# EAGLE schematic 01 (EAGLE 6.5.0)
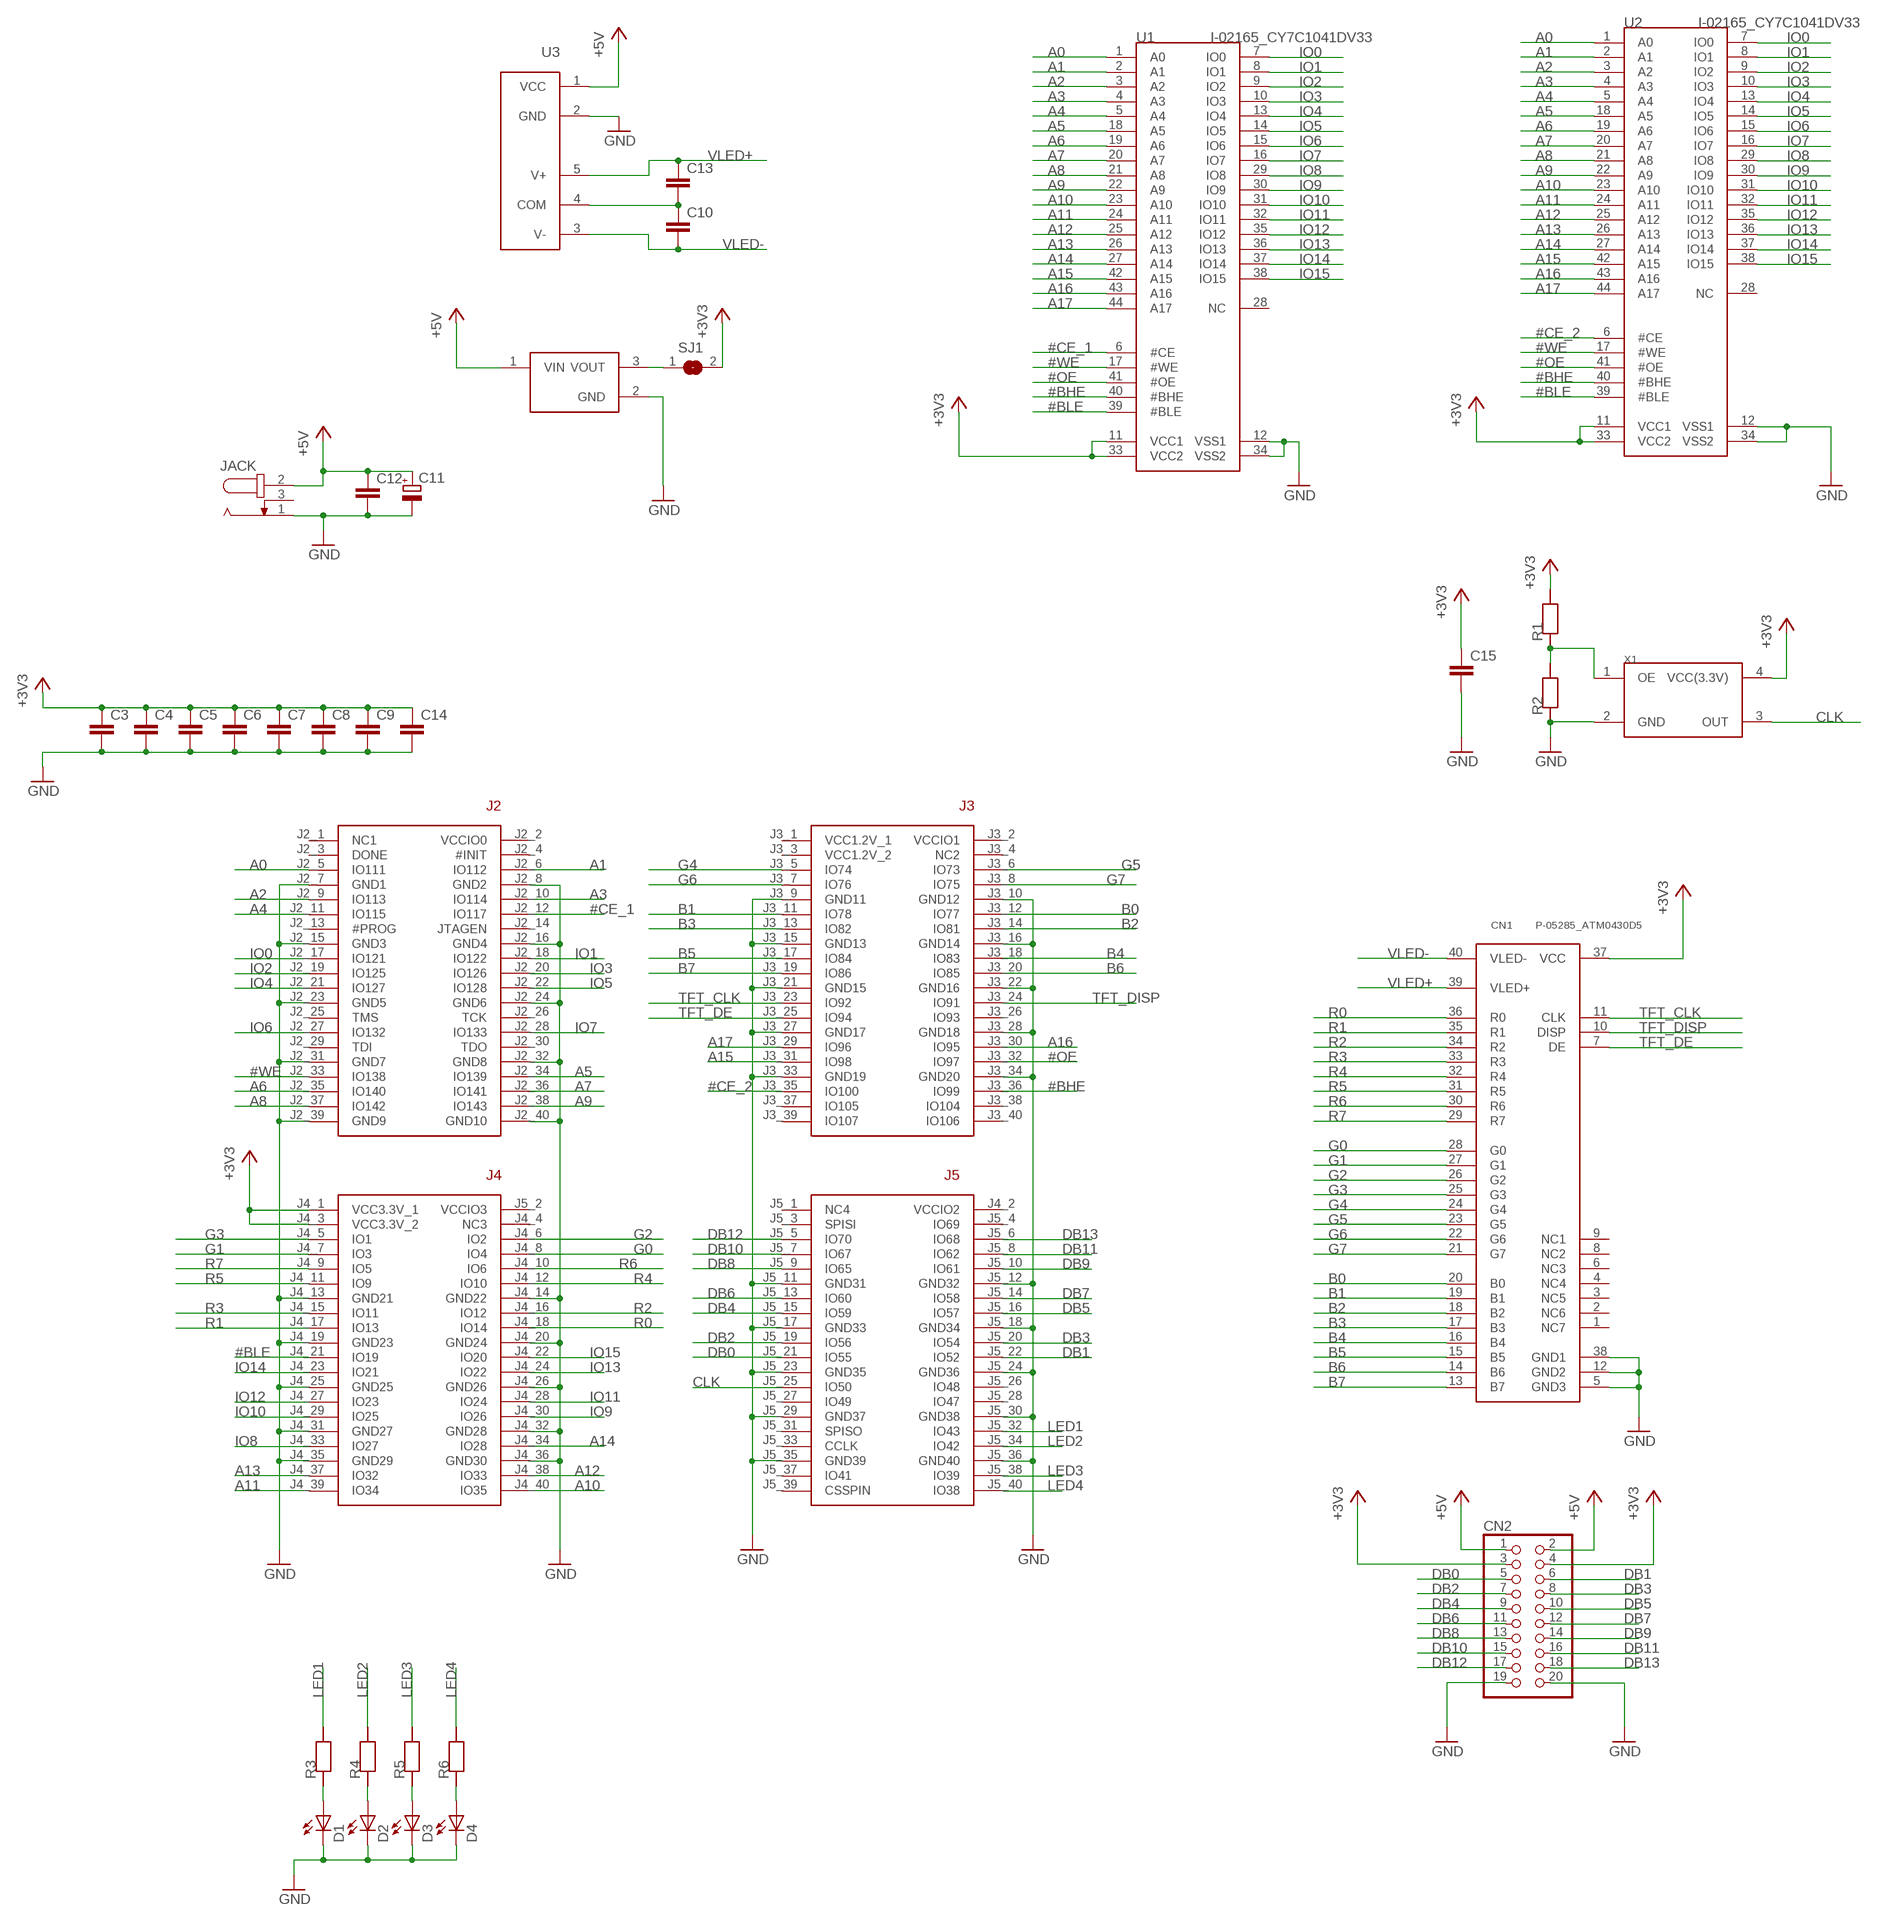
[diagram p0: schematic, sheet 1]

## Parts
C3  C_1068  [C0603]
C4  C_1068  [C0603]
C5  C_1068  [C0603]
C6  C_1068  [C0603]
C7  C_1068  [C0603]
C8  C_1068  [C0603]
C9  C_1068  [C0603]
C10  C_1068  [C0603]
C11  CPOL  [153CLV-0605]
C12  C_1068  [C0603]
C13  C_1068  [C0603]
C14  C_1068  [C0603]
C15  C_1068  [C0603]
CN1  P-05285_ATM0430D5  [FH-40S-0.5SH_0.5]
CN2  PINHD-2X10  [2X10]
D1  LEDCHIPLED_0805  [CHIPLED_0805]
D2  LEDCHIPLED_0805  [CHIPLED_0805]
D3  LEDCHIPLED_0805  [CHIPLED_0805]
D4  LEDCHIPLED_0805  [CHIPLED_0805]
JACK  C-01604_2.1MMJACK  [2.1MMJACK]
R1  R_1068  [R0603]
R2  R_1068  [R0603]
R3  R_1068  [R0603]
R4  R_1068  [R0603]
R5  R_1068  [R0603]
R6  R_1068  [R0603]
SJ1  SJ  [SJ]
U1  I-02165_CY7C1041DV33  [TSOPII-Z44]
U2  I-02165_CY7C1041DV33  [TSOPII-Z44]
U3  M-04135_MAU109  [MAU109]
U4  NJM2845  [TO252]
U$1  M-06174_LCMXO2-7000HE-B-EVN  [LCMXO2-7000HE-B-EVN]
X1  P-05663_CSX-750PB  [CSX-750PB]

## Nets
#BHE: U1.40(#BHE) U2.40(#BHE) U$1.J3_36(IO99)
#BLE: U1.39(#BLE) U2.39(#BLE) U$1.J4_21(IO19)
#CE_1: U1.6(#CE) U$1.J2_12(IO117)
#CE_2: U2.6(#CE) U$1.J3_35(IO100)
#OE: U1.41(#OE) U2.41(#OE) U$1.J3_32(IO97)
#WE: U1.17(#WE) U2.17(#WE) U$1.J2_33(IO138)
+3V3: C3.1 C4.1 C5.1 C6.1 C7.1 C8.1 C9.1 C14.1 C15.1 CN1.37(VCC) CN2.3 CN2.4 R1.2 SJ1.2 U1.11(VCC1) U1.33(VCC2) U2.11(VCC1) U2.33(VCC2) U$1.J4_1(VCC3.3V_1) U$1.J4_3(VCC3.3V_2) X1.4(VCC(3.3V))
+5V: C11.+ C12.1 CN2.1 CN2.2 JACK.2(VCC) U3.1(VCC) U4.1(VIN)
A0: U1.1(A0) U2.1(A0) U$1.J2_5(IO111)
A1: U1.2(A1) U2.2(A1) U$1.J2_6(IO112)
A2: U1.3(A2) U2.3(A2) U$1.J2_9(IO113)
A3: U1.4(A3) U2.4(A3) U$1.J2_10(IO114)
A4: U1.5(A4) U2.5(A4) U$1.J2_11(IO115)
A5: U1.18(A5) U2.18(A5) U$1.J2_34(IO139)
A6: U1.19(A6) U2.19(A6) U$1.J2_35(IO140)
A7: U1.20(A7) U2.20(A7) U$1.J2_36(IO141)
A8: U1.21(A8) U2.21(A8) U$1.J2_37(IO142)
A9: U1.22(A9) U2.22(A9) U$1.J2_38(IO143)
A10: U1.23(A10) U2.23(A10) U$1.J4_40(IO35)
A11: U1.24(A11) U2.24(A11) U$1.J4_39(IO34)
A12: U1.25(A12) U2.25(A12) U$1.J4_38(IO33)
A13: U1.26(A13) U2.26(A13) U$1.J4_37(IO32)
A14: U1.27(A14) U2.27(A14) U$1.J4_34(IO28)
A15: U1.42(A15) U2.42(A15) U$1.J3_31(IO98)
A16: U1.43(A16) U2.43(A16) U$1.J3_30(IO95)
A17: U1.44(A17) U2.44(A17) U$1.J3_29(IO96)
B0: CN1.20(B0) U$1.J3_12(IO77)
B1: CN1.19(B1) U$1.J3_11(IO78)
B2: CN1.18(B2) U$1.J3_14(IO81)
B3: CN1.17(B3) U$1.J3_13(IO82)
B4: CN1.16(B4) U$1.J3_18(IO83)
B5: CN1.15(B5) U$1.J3_17(IO84)
B6: CN1.14(B6) U$1.J3_20(IO85)
B7: CN1.13(B7) U$1.J3_19(IO86)
CLK: U$1.J5_25(IO50) X1.3(OUT)
DB0: CN2.5 U$1.J5_21(IO55)
DB1: CN2.6 U$1.J5_22(IO52)
DB2: CN2.7 U$1.J5_19(IO56)
DB3: CN2.8 U$1.J5_20(IO54)
DB4: CN2.9 U$1.J5_15(IO59)
DB5: CN2.10 U$1.J5_16(IO57)
DB6: CN2.11 U$1.J5_13(IO60)
DB7: CN2.12 U$1.J5_14(IO58)
DB8: CN2.13 U$1.J5_9(IO65)
DB9: CN2.14 U$1.J5_10(IO61)
DB10: CN2.15 U$1.J5_7(IO67)
DB11: CN2.16 U$1.J5_8(IO62)
DB12: CN2.17 U$1.J5_5(IO70)
DB13: CN2.18 U$1.J5_6(IO68)
G0: CN1.28(G0) U$1.J4_8(IO4)
G1: CN1.27(G1) U$1.J4_7(IO3)
G2: CN1.26(G2) U$1.J4_6(IO2)
G3: CN1.25(G3) U$1.J4_5(IO1)
G4: CN1.24(G4) U$1.J3_5(IO74)
G5: CN1.23(G5) U$1.J3_6(IO73)
G6: CN1.22(G6) U$1.J3_7(IO76)
G7: CN1.21(G7) U$1.J3_8(IO75)
GND: C3.2 C4.2 C5.2 C6.2 C7.2 C8.2 C9.2 C11.- C12.2 C14.2 C15.2 CN1.5(GND3) CN1.12(GND2) CN1.38(GND1) CN2.19 CN2.20 D1.C D2.C D3.C D4.C JACK.1(GND) R2.1 U1.12(VSS1) U1.34(VSS2) U2.12(VSS1) U2.34(VSS2) U3.2(GND) U4.2(GND) U$1.J2_7(GND1) U$1.J2_8(GND2) U$1.J2_15(GND3) U$1.J2_16(GND4) U$1.J2_23(GND5) U$1.J2_24(GND6) U$1.J2_31(GND7) U$1.J2_32(GND8) U$1.J2_39(GND9) U$1.J2_40(GND10) U$1.J3_9(GND11) U$1.J3_10(GND12) U$1.J3_15(GND13) U$1.J3_16(GND14) U$1.J3_21(GND15) U$1.J3_22(GND16) U$1.J3_27(GND17) U$1.J3_28(GND18) U$1.J3_33(GND19) U$1.J3_34(GND20) U$1.J4_13(GND21) U$1.J4_14(GND22) U$1.J4_19(GND23) U$1.J4_20(GND24) U$1.J4_25(GND25) U$1.J4_26(GND26) U$1.J4_31(GND27) U$1.J4_32(GND28) U$1.J4_35(GND29) U$1.J4_36(GND30) U$1.J5_11(GND31) U$1.J5_12(GND32) U$1.J5_17(GND33) U$1.J5_18(GND34) U$1.J5_23(GND35) U$1.J5_24(GND36) U$1.J5_29(GND37) U$1.J5_30(GND38) U$1.J5_35(GND39) U$1.J5_36(GND40) X1.2(GND)
IO0: U1.7(IO0) U2.7(IO0) U$1.J2_17(IO121)
IO1: U1.8(IO1) U2.8(IO1) U$1.J2_18(IO122)
IO2: U1.9(IO2) U2.9(IO2) U$1.J2_19(IO125)
IO3: U1.10(IO3) U2.10(IO3) U$1.J2_20(IO126)
IO4: U1.13(IO4) U2.13(IO4) U$1.J2_21(IO127)
IO5: U1.14(IO5) U2.14(IO5) U$1.J2_22(IO128)
IO6: U1.15(IO6) U2.15(IO6) U$1.J2_27(IO132)
IO7: U1.16(IO7) U2.16(IO7) U$1.J2_28(IO133)
IO8: U1.29(IO8) U2.29(IO8) U$1.J4_33(IO27)
IO9: U1.30(IO9) U2.30(IO9) U$1.J4_30(IO26)
IO10: U1.31(IO10) U2.31(IO10) U$1.J4_29(IO25)
IO11: U1.32(IO11) U2.32(IO11) U$1.J4_28(IO24)
IO12: U1.35(IO12) U2.35(IO12) U$1.J4_27(IO23)
IO13: U1.36(IO13) U2.36(IO13) U$1.J4_24(IO22)
IO14: U1.37(IO14) U2.37(IO14) U$1.J4_23(IO21)
IO15: U1.38(IO15) U2.38(IO15) U$1.J4_22(IO20)
LED1: R3.2 U$1.J5_32(IO43)
LED2: R4.2 U$1.J5_34(IO42)
LED3: R5.2 U$1.J5_38(IO39)
LED4: R6.2 U$1.J5_40(IO38)
N$1: C10.1 C13.2 U3.4(COM)
N$3: R1.1 R2.2 X1.1(OE)
N$4: SJ1.1 U4.3(VOUT)
N$9: D1.A R3.1
N$10: D2.A R4.1
N$11: D3.A R5.1
N$12: D4.A R6.1
R0: CN1.36(R0) U$1.J4_18(IO14)
R1: CN1.35(R1) U$1.J4_17(IO13)
R2: CN1.34(R2) U$1.J4_16(IO12)
R3: CN1.33(R3) U$1.J4_15(IO11)
R4: CN1.32(R4) U$1.J4_12(IO10)
R5: CN1.31(R5) U$1.J4_11(IO9)
R6: CN1.30(R6) U$1.J4_10(IO6)
R7: CN1.29(R7) U$1.J4_9(IO5)
TFT_CLK: CN1.11(CLK) U$1.J3_23(IO92)
TFT_DE: CN1.7(DE) U$1.J3_25(IO94)
TFT_DISP: CN1.10(DISP) U$1.J3_24(IO91)
VLED+: C13.1 CN1.39(VLED+) U3.5(V+)
VLED-: C10.2 CN1.40(VLED-) U3.3(V-)
Unconnected: CN1.1(NC7) CN1.2(NC6) CN1.3(NC5) CN1.4(NC4) CN1.6(NC3) CN1.8(NC2) CN1.9(NC1) JACK.3(S) U1.28(NC) U2.28(NC) U$1.J2_1(NC1) U$1.J2_2(VCCIO0) U$1.J2_3(DONE) U$1.J2_4(#INIT) U$1.J2_13(#PROG) U$1.J2_14(JTAGEN) U$1.J2_25(TMS) U$1.J2_26(TCK) U$1.J2_29(TDI) U$1.J2_30(TDO) U$1.J3_1(VCC1.2V_1) U$1.J3_2(VCCIO1) U$1.J3_3(VCC1.2V_2) U$1.J3_4(NC2) U$1.J3_26(IO93) U$1.J3_37(IO105) U$1.J3_38(IO104) U$1.J3_39(IO107) U$1.J3_40(IO106) U$1.J4_2(VCCIO2) U$1.J4_4(NC3) U$1.J5_1(NC4) U$1.J5_2(VCCIO3) U$1.J5_3(SPISI) U$1.J5_4(IO69) U$1.J5_26(IO48) U$1.J5_27(IO49) U$1.J5_28(IO47) U$1.J5_31(SPISO) U$1.J5_33(CCLK) U$1.J5_37(IO41) U$1.J5_39(CSSPIN)

## Library data of the parts
C3-C10 C12-C15 = MyPacklbr:C_1068
C11 = MyPacklbr:CPOL
CN1 = Akizuki:P-05285_ATM0430D5
CN2 = pinhead:PINHD-2X10: PIN HEADER
D1-D4 = led:LED: LED OSRAM: - CHIPLED LG R971, LG N971, LY N971, LG Q971, LY Q971, LO R971, LY R971 LH N974, LH R974 LS Q976, LO Q976, LY Q976 LO Q996 - Hyper CHIPLED LW Q18S LB Q993, LB Q99A, LB R99A - SideLED LS A670, LO A670, LY A670, LG A670, LP A670 LB A673, LV A673, LT A673, LW A673 LH A674 LY A675 LS A676, LA A676, LO A676, LY A676, LW A676 LS A679, LY A679, LG A679 - Hyper Micro SIDELED® LS Y876, LA Y876, LO Y876, LY Y876 LT Y87S - SmartLED LW L88C, LW L88S LB L89C, LB L89S, LG L890 LS L89K, LO L89K, LY L89K LS L896, LA L896, LO L896, LY L896 - TOPLED LS T670, LO T670, LY T670, LG T670, LP T670 LSG T670, LSP T670, LSY T670, LOP T670, LYG T670 LG T671, LOG T671, LSG T671 LB T673, LV T673, LT T673, LW T673 LH T674 LS T676, LA T676, LO T676, LY T676, LB T676, LH T676, LSB T676, LW T676 LB T67C, LV T67C, LT T67C, LS T67K, LO T67K, LY T67K, LW E67C LS E67B, LA E67B, LO E67B, LY E67B, LB E67C, LV E67C, LT E67C LW T67C LS T679, LY T679, LG T679 LS T770, LO T770, LY T770, LG T770, LP T770 LB T773, LV T773, LT T773, LW T773 LH T774 LS E675, LA E675, LY E675, LS T675 LS T776, LA T776, LO T776, LY T776, LB T776 LHGB T686 LT T68C, LB T68C - Hyper Mini TOPLED® LB M676 - Mini TOPLED Santana® LG M470 LS M47K, LO M47K, LY M47K Source: http://www.osram.convergy.de LUXEON: - LUMILED® LXK2-PW12-R00, LXK2-PW12-S00, LXK2-PW14-U00, LXK2-PW14-V00 LXK2-PM12-R00, LXK2-PM12-S00, LXK2-PM14-U00 LXK2-PE12-Q00, LXK2-PE12-R00, LXK2-PE12-S00, LXK2-PE14-T00, LXK2-PE14-U00 LXK2-PB12-K00, LXK2-PB12-L00, LXK2-PB12-M00, LXK2-PB14-N00, LXK2-PB14-P00, LXK2-PB14-Q00 LXK2-PR12-L00, LXK2-PR12-M00, LXK2-PR14-Q00, LXK2-PR14-R00 LXK2-PD12-Q00, LXK2-PD12-R00, LXK2-PD12-S00 LXK2-PH12-R00, LXK2-PH12-S00 LXK2-PL12-P00, LXK2-PL12-Q00, LXK2-PL12-R00 Source: www.luxeon.com KINGBRIGHT: KA-3528ASYC Source: www.kingbright.com
JACK = Akizuki:C-01604_2.1MMJACK
R1-R6 = MyPacklbr:R_1068
SJ1 = jumper:SJ: SMD solder JUMPER
U1 U2 = Akizuki:I-02165_CY7C1041DV33
U3 = Akizuki:M-04135_MAU109
U4 = MyPacklbr:NJM2845
U$1 = Akizuki:M-06174_LCMXO2-7000HE-B-EVN
X1 = Akizuki:P-05663_CSX-750PB

## Net classes
1 GND: width 0.1 mm, drill 0.2 mm